# Altium schematic sheet Rov_Kumanda_v2.SchDoc
size A4
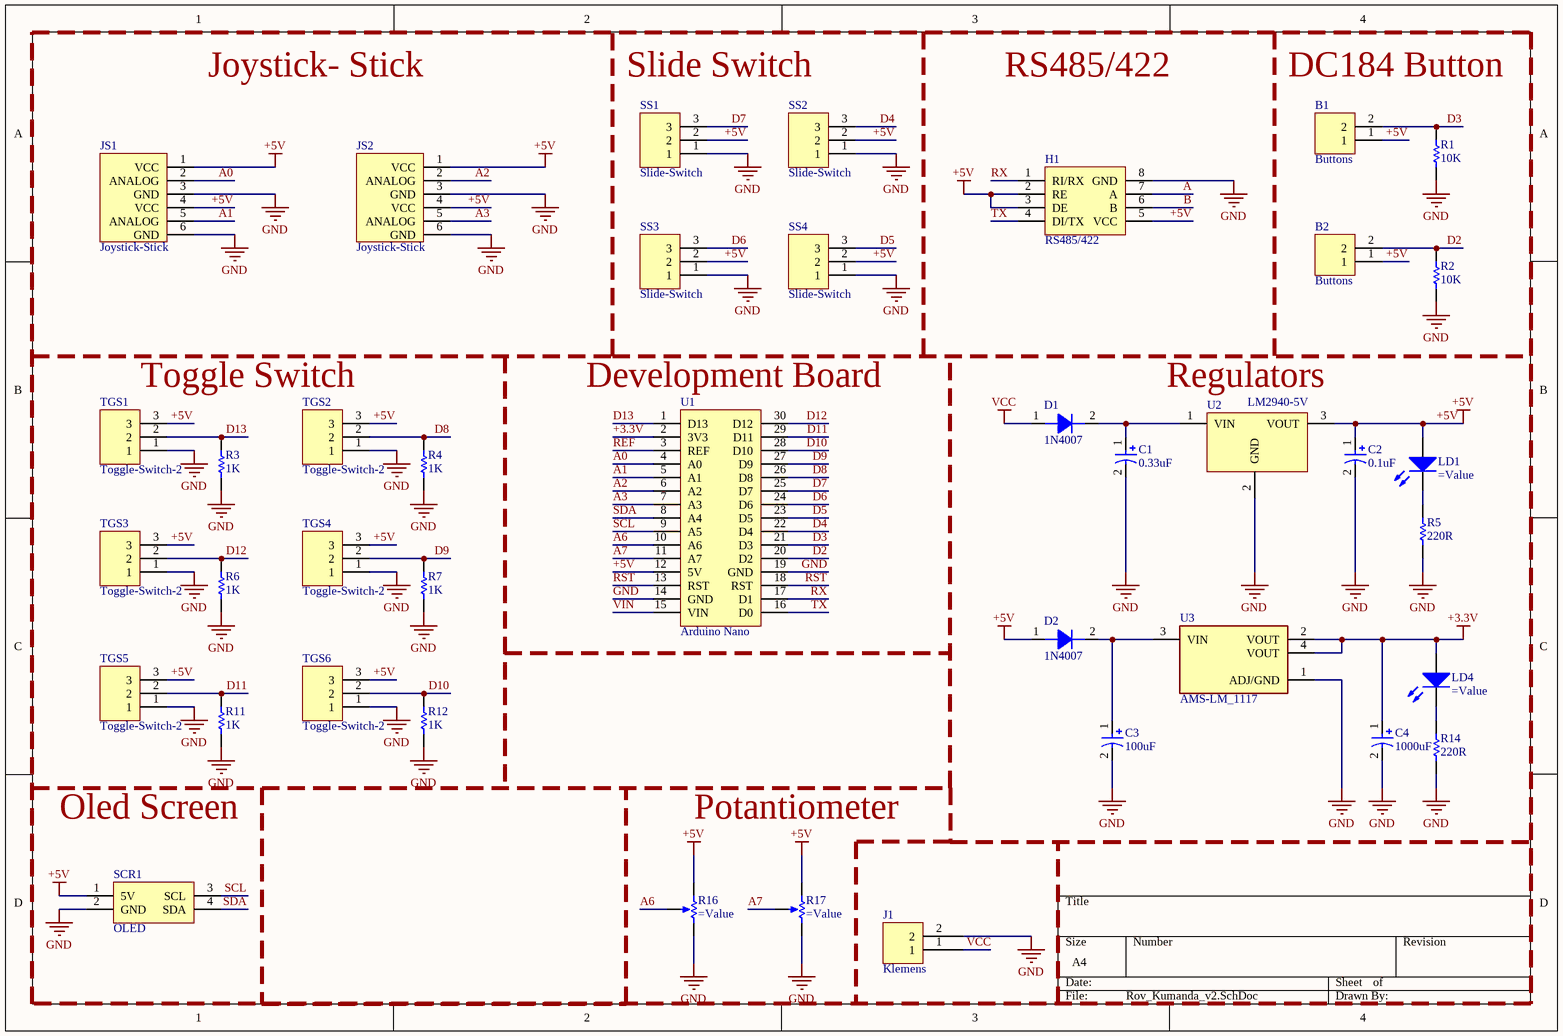
[diagram p0: Rov_Kumanda_v2.SchDoc]

## Parts
B1  Buttons  [Buttons]
B2  Buttons  [Buttons]
C1  0.33uF  [PolarizedCap]
C2  0.1uF  [PolarizedCap]
C3  100uF  [PolarizedCap]
C4  1000uF  [PolarizedCap]
D1  1N4007  [THT]
D2  1N4007  [THT]
H1  RS485/422  [RS485/422]
J1  Klemens  [klemens_3.5mm]
JS1  Joystick-Stick  [Joystick-Stick]
JS2  Joystick-Stick  [Joystick-Stick]
LD1  (no value)  [THT_LED]
LD4  (no value)  [THT_LED]
R1  10K  [THT_Resistor]
R2  10K  [THT_Resistor]
R3  1K  [THT_Resistor]
R4  1K  [THT_Resistor]
R5  220R  [THT_Resistor]
R6  1K  [THT_Resistor]
R7  1K  [THT_Resistor]
R11  1K  [THT_Resistor]
R12  1K  [THT_Resistor]
R14  220R  [THT_Resistor]
R16  (no value)  [THT_Potantiometer]
R17  (no value)  [THT_Potantiometer]
SCR1  OLED  [128*64_OLED]
SS1  Slide-Switch  [Slide_Switch]
SS2  Slide-Switch  [Slide_Switch]
SS3  Slide-Switch  [Slide_Switch]
SS4  Slide-Switch  [Slide_Switch]
TGS1  Toggle-Switch-2  [Toggle_Switch]
TGS2  Toggle-Switch-2  [Toggle_Switch]
TGS3  Toggle-Switch-2  [Toggle_Switch]
TGS4  Toggle-Switch-2  [Toggle_Switch]
TGS5  Toggle-Switch-2  [Toggle_Switch]
TGS6  Toggle-Switch-2  [Toggle_Switch]
U1  Arduino Nano  [Arduino-Nano]
U2  LM2940-5V  [TO220]
U3  AMS-LM_1117  [SOT223]

## Nets
+3.3V: C4.1(P) LD4.2(A) U1.2(3V3) U3.2(VOUT) U3.4(VOUT)
+5V: B1.1 B2.1 C2.1(P) D2.1(A) H1.2(RE) H1.3(DE) H1.5(VCC) JS1.1(VCC) JS1.4(VCC) JS2.1(VCC) JS2.4(VCC) LD1.2(A) R16.1(TOP) R17.1(TOP) SCR1.1(5V) SS1.2 SS2.2 SS3.2 SS4.2 TGS1.3 TGS2.3 TGS3.3 TGS4.3 TGS5.3 TGS6.3 U1.12(5V) U2.3(VOUT)
GND: C1.2(N) C2.2(N) C3.2(N) C4.2(N) H1.8(GND) J1.2 JS1.3(GND) JS1.6(GND) JS2.3(GND) JS2.6(GND) R1.1 R2.1 R3.1 R4.1 R5.1 R6.1 R7.1 R11.1 R12.1 R14.1 R16.2(BOT) R17.2(BOT) SCR1.2(GND) SS1.1 SS2.1 SS3.1 SS4.1 TGS1.1 TGS2.1 TGS3.1 TGS4.1 TGS5.1 TGS6.1 U1.14(GND) U1.19(GND) U2.2(GND) U3.1(ADJ/GND)
VCC: D1.1(A) J1.1
A: H1.7(A)
A0: JS1.2(ANALOG) U1.4(A0)
A1: JS1.5(ANALOG) U1.5(A1)
A2: JS2.2(ANALOG) U1.6(A2)
A3: JS2.5(ANALOG) U1.7(A3)
A6: R16.3(TAP) U1.10(A6)
A7: R17.3(TAP) U1.11(A7)
B: H1.6(B)
D2: B2.2 R2.2 U1.20(D2)
D3: B1.2 R1.2 U1.21(D3)
D4: SS2.3 U1.22(D4)
D5: SS4.3 U1.23(D5)
D6: SS3.3 U1.24(D6)
D7: SS1.3 U1.25(D7)
D8: R4.2 TGS2.2 U1.26(D8)
D9: R7.2 TGS4.2 U1.27(D9)
D10: R12.2 TGS6.2 U1.28(D10)
D11: R11.2 TGS5.2 U1.29(D11)
D12: R6.2 TGS3.2 U1.30(D12)
D13: R3.2 TGS1.2 U1.1(D13)
REF: U1.3(REF)
RST: U1.13(RST) U1.18(RST)
RX: H1.1(RI/RX) U1.17(D1)
SCL: SCR1.3(SCL) U1.9(A5)
SDA: SCR1.4(SDA) U1.8(A4)
TX: H1.4(DI/TX) U1.16(D0)
VIN: U1.15(VIN)
NetC1_1: C1.1(P) D1.2(K) U2.1(VIN)
NetC3_1: C3.1(P) D2.2(K) U3.3(VIN)
NetLD1_1: LD1.1(K) R5.2
NetLD4_1: LD4.1(K) R14.2

## Notes on the sheet
- Joystick- Stick
- Slide Switch
- RS485/422
- DC184 Button
- Toggle Switch
- (near U1) Development Board
- (near U2) Regulators
- Oled Screen
- Potantiometer

## Library data of the parts
C1-C4 = UMA1HR33MDD1TP: Cap Alum 0.33UF 20% 50V Radial; Manufacturer: Nichicon; Life (Hours): 2000Hour; Capacitance: 330nF; Ripple Current: 2.8mA; Manufacturer Part Number: UMA1HR33MDD1TP; Supplier 1: Digi-Key; Supplier Part Number 1: 493-10465-3-ND; RoHS: Yes; Category: Aluminum Electrolytic Capacitors; Stock 1: 6000; Pricing 1: 2000=0,04781, 4000=0,04346, 10000=0,04129, 14000=0,03911, 50000=0,03477, 100000=0,02955 (USD); Mount: Through Hole; Case/Package: Radial; Min Operating Temperature: -40°C; Max Operating Temperature: 85°C; Package Quantity: 2000; Packaging: Tape and Reel; Tolerance: 20%; Voltage Rating: 50V; Lead Pitch: 0.059inch; Height - Seated (Max): 0.236inch; ComponentLink1URL: https://datasheet.ciiva.com/29545/e-ma-29545464.pdf?src-supplier=Digi-Key; ComponentLink1Description: https://datasheet.ciiva.com/29545/e-ma-29545464.pdf?src-supplier=Digi-Key; ComponentLink2URL: https://datasheet.ciiva.com/29545/e-ma-29545465.pdf?src-supplier=Digi-Key; ComponentLink2Description: https://datasheet.ciiva.com/29545/e-ma-29545465.pdf?src-supplier=Digi-Key
D1 D2 = 1N4007: Diode 1KV 1A 2-Pin DO-41 T/R; Manufacturer: ON Semiconductor / Fairchild; Capacitance: 15pF; Element Configuration: Single; Peak Reverse Current: 5uA; Max Forward Surge Current (Ifsm): 30A; Polarity: Standard; Forward Voltage: 1.1V; Power Dissipation: 3W; Manufacturer Part Number: 1N4007; Supplier 1: Farnell; Supplier Part Number 1: 1467514; RoHS: Yes; Category: Integrated Circuits (ICs); Stock 1: 375000; Pricing 1: 1=0,17200, 10=0,16000, 100=0,05560, 500=0,04900, 1000=0,03000, 2500=0,01440 (EUR); Mount: Through Hole; Number of Pins: 2; Min Operating Temperature: -65°C; Max Operating Temperature: 175°C; Packaging: Tape and Reel; Voltage Rating (DC): 1kV; Package Quantity: 1000; Length: 5.2mm; Height: 5.2mm; Width: 2.72mm; Radiation Hardening: No; Lead Free: Lead Free; REACH SVHC: No SVHC; ComponentLink1URL: https://datasheet.ciiva.com/1239/1n4005-1239313.pdf?src-supplier=Newark; ComponentLink1Description: https://datasheet.ciiva.com/1239/1n4005-1239313.pdf?src-supplier=Newark; ComponentLink2URL: https://datasheet.ciiva.com/910/1n4001-910361.pdf?src-supplier=Digi-Key; ComponentLink2Description: https://datasheet.ciiva.com/910/1n4001-910361.pdf?src-supplier=Digi-Key; ComponentLink3URL: https://datasheet.ciiva.com/927/1n4001-d-927427.pdf?src-supplier=Digi-Key; ComponentLink3Description: https://datasheet.ciiva.com/927/1n4001-d-927427.pdf?src-supplier=Digi-Key; ComponentLink4URL: https://datasheet.ciiva.com/910/1n4001-910362.pdf?src-supplier=Digi-Key; ComponentLink4Description: https://datasheet.ciiva.com/910/1n4001-910362.pdf?src-supplier=Digi-Key; Contact Plating: Tin,Matte; Weight: 0.245g; Max Repetitive Reverse Voltage (Vrrm): 1kV; Current Rating: 1A; Output Current: 1A; Peak Non-Repetitive Surge Current: 30A; Max Surge Current: 30A; Forward Current: 1A; Max Reverse Voltage (DC): 1kV; Average Rectified Current: 1A; Reverse Voltage: 1kV; Diameter: 2.72mm
JS1 JS2 = THB001P: Manufacturer: ITT C&K; Manufacturer Part Number: THB001P; Supplier 1: Arrow; Supplier Part Number 1: THB001P; RoHS: No; Stock 1: 1200; Pricing 1: 1=1,60440, 5=1,55580, 10=1,31650, 25=1,23850, 50=1,16180, 100=1,05260 (USD)
LD1 LD4 = 151031SS06000: LED 3 mm (T1) red, 151031SS06000, Würth Elektronik; Manufacturer: Wurth Electronics; Forward Voltage: 2.2V; Forward Current: 30mA; Lens Style: Diffused,Circular,Round; Wavelength: 630nm; Luminous Intensity: 35mcd; Viewing Angle: 60°; Dominant Wavelength: 640nm; Test Current: 20mA; Lens Size: 3mm; Manufacturer Part Number: 151031SS06000; Supplier 1: Mouser; Supplier Part Number 1: 710-151031SS06000; RoHS: Yes; Category: LEDs; Stock 1: 2754; Pricing 1: 1=0,18000, 10=0,17200, 25=0,17200, 50=0,16100, 100=0,13800, 250=0,13800 (USD); Mount: Through Hole; Case/Package: Radial; Min Operating Temperature: -40°C; Max Operating Temperature: 85°C; Packaging: Bulk; Package Quantity: 1; Height: 5.55mm; REACH SVHC: Unknown; ComponentLink1URL: https://datasheet.ciiva.com/22657/151031ss06000-22657010.pdf?src-supplier=Element14; ComponentLink1Description: https://datasheet.ciiva.com/22657/151031ss06000-22657010.pdf?src-supplier=Element14; ComponentLink2URL: https://datasheet.ciiva.com/29335/759483-da-01-en-tht-led-3mm-superrot-151031ss06000-29335440.pdf?src-supplier=Conrad; ComponentLink2Description: https://datasheet.ciiva.com/29335/759483-da-01-en-tht-led-3mm-superrot-151031ss06000-29335440.pdf?src-supplier=Conrad; ComponentLink3URL: https://datasheet.ciiva.com/29562/151031ss06000-29562907.pdf?src-supplier=Digi-Key; ComponentLink3Description: https://datasheet.ciiva.com/29562/151031ss06000-29562907.pdf?src-supplier=Digi-Key; Color: Red
R1-R7 R11 R12 R14 = MBA02040C2200FC100: MBA0204 M/F Res,  0.4W 50PPM 1% 220R; Manufacturer: Vishay Beyschlag; Temperature Coefficient: 50ppm/°C; Power Rating: 400mW; Voltage Rating: 200V; Lead Diameter: 0.5mm; Manufacturer Part Number: MBA02040C2200FC100; Value: 220R; Supplier 1: RSComponents; Supplier Part Number 1: 157569; RoHS: Yes; Category: Chip SMD Resistors; Stock 1: 400; Mount: Through Hole; Case/Package: Axial; Contact Plating: Tin; Min Operating Temperature: -55°C; Max Operating Temperature: 155°C; Tolerance: 1%; Resistance: 220R; Packaging: Tape and Reel; Composition: Thin Film; Package Quantity: 1000; Number of Terminations: 2; Termination: Axial; Max Power Dissipation: 400mW; Military Standard: Not; Features: Automotive AEC-Q200; Diameter: 1.6mm; Length: 3.6mm; Lead Pitch: 5mm; Radiation Hardening: No; Lead Free: Lead Free; ComponentLink1URL: http://components.arrow.com/part/dataview/0323_01827035?src-supplier=Arrow+Europe; ComponentLink1Description: http://components.arrow.com/part/dataview/0323_01827035?src-supplier=Arrow+Europe; ComponentLink2URL: http://www.mouser.com/ds/2/427/mbxsma-239744.pdf?src-supplier=Mouser; ComponentLink2Description: http://www.mouser.com/ds/2/427/mbxsma-239744.pdf?src-supplier=Mouser; ComponentLink3URL: http://uk.rs-online.com/webdocs/09bb/0900766b809bb010.pdf?src-supplier=RSComponents; ComponentLink3Description: http://uk.rs-online.com/webdocs/09bb/0900766b809bb010.pdf?src-supplier=RSComponents; ComponentLink4URL: http://www.alliedelec.com/m/d/72a9b4b9281933b6a3b8fa3f9583e3eb.pdf?src-supplier=Allied+Electronics; ComponentLink4Description: http://www.alliedelec.com/m/d/72a9b4b9281933b6a3b8fa3f9583e3eb.pdf?src-supplier=Allied+Electronics; ComponentLink5URL: http://www.vishay.com/docs/28766/28766.pdf?src-supplier=Avnet+Europe; ComponentLink5Description: http://www.vishay.com/docs/28766/28766.pdf?src-supplier=Avnet+Europe; ComponentLink6URL: http://www.vishay.com/docs/28766/28766.pdf?src-supplier=Avnet; ComponentLink6Description: http://www.vishay.com/docs/28766/28766.pdf?src-supplier=Avnet
R16 R17 = 026TB32R101B1A1: Potentiometers 100ohms 20% Round Linear Res.; Manufacturer: CTS; Resistance: 100R; Power Rating: 5W; Voltage Rating: 500V; Number of Gangs: 1; Actuator Length: 1inch; Actuator Diameter: 0.25inch; Manufacturer Part Number: 026TB32R101B1A1; Supplier 1: Mouser; Supplier Part Number 1: 774-026TB32R101B1A1; RoHS: Yes; Category: Variable Resistors and Potentiometers; Stock 1: 1452; Mount: Panel; Min Operating Temperature: -30°C; Max Operating Temperature: 85°C; Tolerance: 20%; Packaging: Bulk; Composition: Wirewound; Package Quantity: 1000; Termination: Solder; Max Power Dissipation: 5W; Diameter: 23.8mm; Length: 37.3mm; ComponentLink1URL: https://datasheet.ciiva.com/29902/026-29902268.pdf?src-supplier=Avnet; ComponentLink1Description: https://datasheet.ciiva.com/29902/026-29902268.pdf?src-supplier=Avnet; ComponentLink2URL: https://datasheet.ciiva.com/4993/026-4993039.pdf?src-supplier=Mouser; ComponentLink2Description: https://datasheet.ciiva.com/4993/026-4993039.pdf?src-supplier=Mouser; Pricing 1: 1=5,23000, 10=4,01000, 100=3,66000, 250=2,97000, 500=2,79000, 1000=2,62000 (USD); Housing Material: Metal; Taper: Linear; Number of Turns: 1; Type: Potentiometer; Height: 11.9mm
SCR1 = LCD-10168: Lcd Graphic 84X48 Nokia 5110; Manufacturer: SparkFun; Resolution (height): 48pixel; Resolution (width): 84pixel; Manufacturer Part Number: LCD-10168; Supplier 1: Mouser; Supplier Part Number 1: 474-LCD-10168; RoHS: No; Category: LCD, OLED, Graphic Displays; Stock 1: 108; Pricing 1: 1=9,95000, 5=9,95000 (USD); ComponentLink1URL: https://media.digikey.com/pdf/Data%20Sheets/Sparkfun%20PDFs/LCD%E2%80%9010168_Web.pdf?src-supplier=Digi-Key; ComponentLink1Description: https://media.digikey.com/pdf/Data%20Sheets/Sparkfun%20PDFs/LCD%E2%80%9010168_Web.pdf?src-supplier=Digi-Key
SS1-SS4 = JS202011SCQN: C & K COMPONENTS - JS202011SCQN - SWITCH, DPDT, 0.6A, 6VDC, SMD; Manufacturer: ITT C&K; Switch Travel: 2mm; Actuator Type: Standard; Switch Function: On-On; Electrical Life: 5000Cycles; Voltage Rating (DC): 6V; Contact Resistance: 70mR; Current Rating: 300mA; Actuator Material: Nylon,Polyamide; Manufacturer Part Number: JS202011SCQN; Supplier 1: Avnet; Supplier Part Number 1: JS202011SCQN; RoHS: Yes; Category: Slide Switches; Stock 1: 2000; Pricing 1: 1000=0,34030, 2000=0,33005, 4000=0,31365, 6000=0,30545, 8000=0,29110 (USD); Mount: Surface Mount; Contact Plating: Silver; Min Operating Temperature: -20°C; Max Operating Temperature: 85°C; Termination: Gull Wing; Throw Configuration: DPDT; Packaging: Tape and Reel; Max Voltage Rating (DC): 6V; Package Quantity: 1; Max Current Rating: 300mA; Orientation: Vertical; Length: 9mm; Actuator Length: 2mm; Depth: 7.5mm; Radiation Hardening: No; ComponentLink1URL: https://datasheet.ciiva.com/23829/1707718-23829488.pdf?src-supplier=Newark; ComponentLink1Description: https://datasheet.ciiva.com/23829/1707718-23829488.pdf?src-supplier=Newark; ComponentLink2URL: https://datasheet.ciiva.com/2889/js-29aug13-2889127.pdf?src-supplier=Digi-Key; ComponentLink2Description: https://datasheet.ciiva.com/2889/js-29aug13-2889127.pdf?src-supplier=Digi-Key; ComponentLink3URL: https://datasheet.ciiva.com/2889/js-15sept15-2889128.pdf?src-supplier=Digi-Key; ComponentLink3Description: https://datasheet.ciiva.com/2889/js-15sept15-2889128.pdf?src-supplier=Digi-Key; ComponentLink4URL: https://datasheet.ciiva.com/2889/js-15sept15-2889129.pdf?src-supplier=Digi-Key; ComponentLink4Description: https://datasheet.ciiva.com/2889/js-15sept15-2889129.pdf?src-supplier=Digi-Key; Contact Material: Copper Alloy; Housing Material: Nylon; Contact Current Rating: 300mA; REACH SVHC: No SVHC; Lead Free: Lead Free; Flammability Rating: UL94 V-2; ComponentLink5URL: https://datasheet.ciiva.com/22630/1707718-22630697.pdf?src-supplier=Element14; ComponentLink5Description: https://datasheet.ciiva.com/22630/1707718-22630697.pdf?src-supplier=Element14; ComponentLink6URL: https://datasheet.ciiva.com/8625/js-9dec14-8625470.pdf?src-supplier=Avnet; ComponentLink6Description: https://datasheet.ciiva.com/8625/js-9dec14-8625470.pdf?src-supplier=Avnet
TGS1-TGS6 = 100SP1T1B4M2QE: E-SWITCH - 100SP1T1B4M2QE - SWITCH, TOGGLE, SPDT, 5A, 120VAC, 28VDC; Actuator Type: Standard Round; Switch Function: On-On; Illumination Type: Non-Illuminated,Illuminated; Electrical Life: 40000Cycles; Voltage Rating (DC): 28V; Actuator Length: 12.19mm; Actuator Material: Brass,Chrome; Voltage Rating (AC): 120V; Manufacturer Part Number: 100SP1T1B4M2QE; Supplier 1: Future Electronics; Supplier Part Number 1: 100SP1T1B4M2QE-BULK; Manufacturer: E-Switch; RoHS: Yes; Category: Toggle Switches; Stock 1: 49; Pricing 1: 1=2,16000, 30=1,85000, 75=1,77000, 200=1,69000, 400=1,64000 (USD); Mount: Through Hole; Contact Plating: Silver; Min Operating Temperature: -30°C; Max Operating Temperature: 85°C; Termination: PC Pin; Throw Configuration: SPDT; Packaging: Bulk; Current Rating: 5A; Package Quantity: 1; Orientation: Vertical; ComponentLink1URL: https://datasheet.ciiva.com/24455/t111597-24455739.pdf?src-supplier=Onlinecomponents.com; ComponentLink1Description: https://datasheet.ciiva.com/24455/t111597-24455739.pdf?src-supplier=Onlinecomponents.com; ComponentLink2URL: https://datasheet.ciiva.com/2905/t111597-2905494.pdf?src-supplier=Digi-Key; ComponentLink2Description: https://datasheet.ciiva.com/2905/t111597-2905494.pdf?src-supplier=Digi-Key; Contact Material: Silver; Lead Free: Lead Free
U1 = A000005: ARDUINO - A000005 - Development Board, Arduino Nano, ATmega328 MCU, 14 3.3V I/O, 6 PWM Outputs, USB Mini B; Core Architecture: AVR; Evaluation Kit: Yes; Number of Bits: 8; Data Bus Width: 8b; Operating Supply Voltage: 20V; Interface: I2C,SPI,USB; Manufacturer Part Number: A000005; Supplier 1: Mouser; Supplier Part Number 1: 782-A000005; Manufacturer: Arduino; RoHS: Yes; Category: Embedded Processors and Controllers; Stock 1: 282; Pricing 1: 1=22,00000, 5=22,00000 (USD); Weight: 0.02lb; Package Quantity: 1; Packaging: Bulk; Length: 7inch; Height: 0.25inch; Width: 5inch; REACH SVHC: No SVHC; ComponentLink1URL: https://datasheet.ciiva.com/2398/arduinonanomanual23-2398236.pdf?src-supplier=Digi-Key; ComponentLink1Description: https://datasheet.ciiva.com/2398/arduinonanomanual23-2398236.pdf?src-supplier=Digi-Key; ComponentLink2URL: https://datasheet.ciiva.com/19455/2121148-19455443.pdf?src-supplier=Jameco; ComponentLink2Description: https://datasheet.ciiva.com/19455/2121148-19455443.pdf?src-supplier=Jameco; ComponentLink3URL: https://datasheet.ciiva.com/1336/1682238-1336473.pdf?src-supplier=Element14; ComponentLink3Description: https://datasheet.ciiva.com/1336/1682238-1336473.pdf?src-supplier=Element14; ComponentLink4URL: https://datasheet.ciiva.com/1414/810078-1414124.pdf?src-supplier=Newark; ComponentLink4Description: https://datasheet.ciiva.com/1414/810078-1414124.pdf?src-supplier=Newark; ComponentLink5URL: https://datasheet.ciiva.com/4926/arduino-arduinoboardnano-188748-4926316.pdf?src-supplier=Mouser; ComponentLink5Description: https://datasheet.ciiva.com/4926/arduino-arduinoboardnano-188748-4926316.pdf?src-supplier=Mouser; ComponentLink6URL: https://datasheet.ciiva.com/20168/73-4448-20168542.pdf?src-supplier=Rapid+Electronics; ComponentLink6Description: https://datasheet.ciiva.com/20168/73-4448-20168542.pdf?src-supplier=Rapid+Electronics
U2 = LM7805CT/NOPB: Series 3-Terminal Positive Regulators; Manufacturer: Texas Instruments; Output Voltage: 5V; Number of Outputs: 1; Min Input Voltage: 10V; Max Input Voltage: 35V; Output Type: Fixed; Quiescent Current: 8mA; Dropout Voltage: 2V; Output Current: 1A; Accuracy: 2%; Manufacturer Part Number: LM7805CT/NOPB; Supplier 1: Avnet; Supplier Part Number 1: LM7805CT/NOPB; RoHS: Yes; Category: Voltage Regulators - Linear; Stock 1: 5; Pricing 1: 495=0,89052, 585=0,88949, 1080=0,86889, 2475=0,68252, 4950=0,66213 (USD); Mount: Through Hole; Case/Package: TO-220; Number of Pins: 3; Min Operating Temperature: 0°C; Max Operating Temperature: 125°C; Polarity: Positive; Packaging: Rail/Tube; Package Quantity: 45; Max Output Current: 1A; Length: 10.16mm; Height: 8.89mm; Width: 4.7mm; Radiation Hardening: No; Lead Free: Contains Lead; ComponentLink1URL: https://datasheet.ciiva.com/45987/902071-45987836.pdf?src-supplier=Jameco; ComponentLink1Description: https://datasheet.ciiva.com/45987/902071-45987836.pdf?src-supplier=Jameco; ComponentLink2URL: https://datasheet.ciiva.com/15083/lm7805c-15083790.pdf?src-supplier=Digi-Key; ComponentLink2Description: https://datasheet.ciiva.com/15083/lm7805c-15083790.pdf?src-supplier=Digi-Key; ComponentLink3URL: https://datasheet.ciiva.com/14280/lm340-n-14280911.pdf?src-supplier=Avnet; ComponentLink3Description: https://datasheet.ciiva.com/14280/lm340-n-14280911.pdf?src-supplier=Avnet; Output Voltage Accuracy: 2%; Number of Regulators: 1
U3 = LM1117IMPX-5.0/NOPB: TEXAS INSTRUMENTS - LM1117IMPX-5.0/NOPB - LDO VOLTAGE REGULATOR, FIXED, 5V, 800mA, SOT-223-4, FULL REEL; Manufacturer: TI National Semiconductor; Number of Outputs: 1; Min Input Voltage: 2.6V; Max Input Voltage: 15V; Quiescent Current: 15mA; Polarity: Positive; Dropout Voltage: 1.2V; Accuracy: 1%; Manufacturer Part Number: LM1117IMPX-5.0/NOPB; Supplier 1: Mouser; Supplier Part Number 1: 926-LM1117IMPX50NOPB; RoHS: Yes; Category: Voltage Regulators - Linear; Stock 1: 2047; Pricing 1: 1=1,11000, 10=0,93600, 100=0,71900, 250=0,63500, 500=0,60200, 1000=0,46800 (USD); Mount: Surface Mount; Case/Package: SOT-223; Number of Pins: 4; Contact Plating: Tin; Min Operating Temperature: -40°C; Max Operating Temperature: 125°C; Output Voltage: 5V; Output Type: Fixed; Output Current: 800mA; Packaging: Tape and Reel; Package Quantity: 2000; Max Output Current: 800mA; Nominal Output Voltage: 5V; Radiation Hardening: No; Lead Free: Lead Free; REACH SVHC: No SVHC; ComponentLink1URL: https://datasheet.ciiva.com/22735/1882372-22735013.pdf?src-supplier=Element14; ComponentLink1Description: https://datasheet.ciiva.com/22735/1882372-22735013.pdf?src-supplier=Element14; ComponentLink2URL: https://datasheet.ciiva.com/6591/lm1117-n-6591866.pdf?src-supplier=Digi-Key; ComponentLink2Description: https://datasheet.ciiva.com/6591/lm1117-n-6591866.pdf?src-supplier=Digi-Key; ComponentLink3URL: https://datasheet.ciiva.com/6591/lm1117-n-6591868.pdf?src-supplier=Digi-Key; ComponentLink3Description: https://datasheet.ciiva.com/6591/lm1117-n-6591868.pdf?src-supplier=Digi-Key; ComponentLink4URL: https://datasheet.ciiva.com/6591/lm1117-n-6591869.pdf?src-supplier=Digi-Key; ComponentLink4Description: https://datasheet.ciiva.com/6591/lm1117-n-6591869.pdf?src-supplier=Digi-Key; ComponentLink5URL: https://datasheet.ciiva.com/46384/1882372-46384846.pdf?src-supplier=Element14; ComponentLink5Description: https://datasheet.ciiva.com/46384/1882372-46384846.pdf?src-supplier=Element14; ComponentLink6URL: https://datasheet.ciiva.com/3223/lm1117-n-3223519.pdf?src-supplier=Avnet; ComponentLink6Description: https://datasheet.ciiva.com/3223/lm1117-n-3223519.pdf?src-supplier=Avnet; Output Voltage Accuracy: 1%; Number of Regulators: 1; Min Current Limit: 800mA